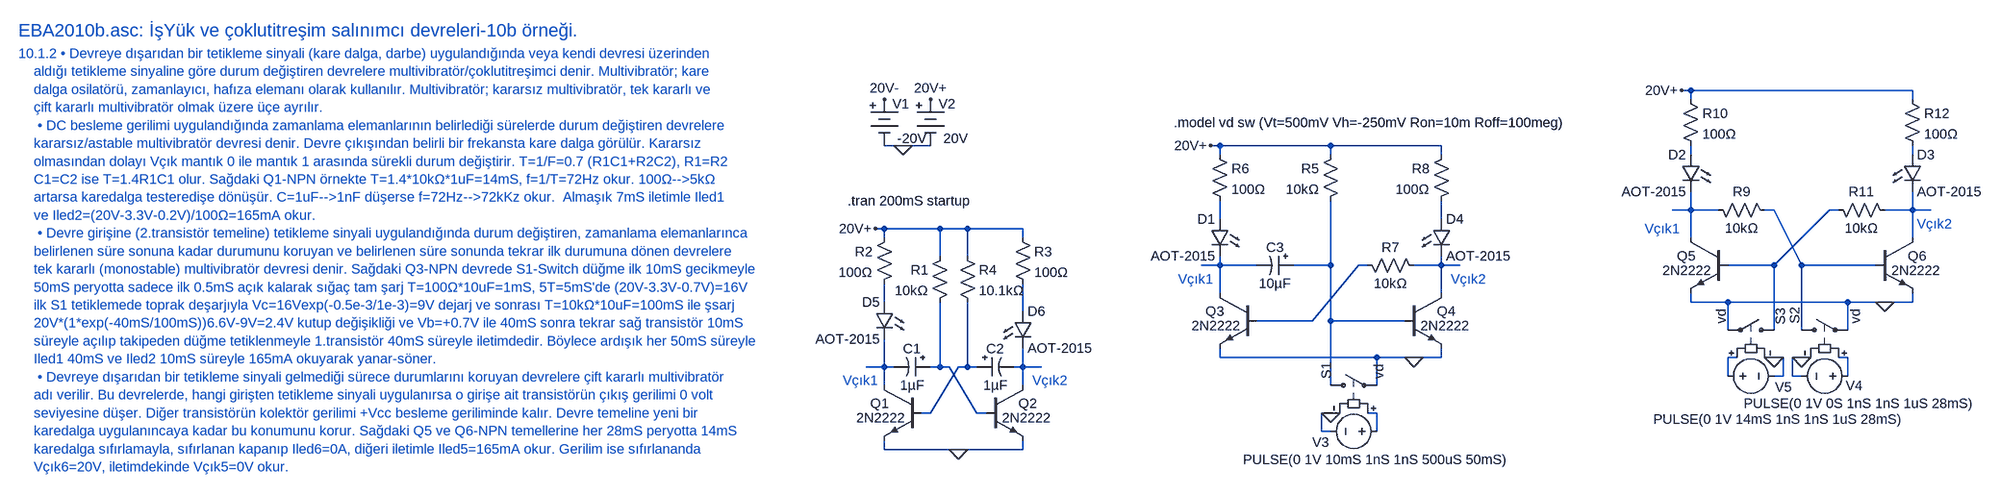
[diagram p0: schematic EBA2010b.asc]
EBA2010b.asc, the LTspice schematic file:
Version 4
SHEET 1 7064 4332
WIRE 2992 160 2976 160
WIRE 3376 160 2992 160
WIRE 2992 176 2992 160
WIRE 3376 176 3376 160
WIRE 1552 256 1520 256
WIRE 1600 256 1552 256
WIRE 2176 256 2160 256
WIRE 2368 256 2176 256
WIRE 2560 256 2368 256
WIRE 2176 272 2176 256
WIRE 2368 272 2368 256
WIRE 2560 272 2560 256
WIRE 2992 272 2992 256
WIRE 3376 272 3376 256
WIRE 2992 368 2992 336
WIRE 2992 368 2960 368
WIRE 3040 368 2992 368
WIRE 3136 368 3120 368
WIRE 3248 368 3232 368
WIRE 3376 368 3376 336
WIRE 3376 368 3328 368
WIRE 3408 368 3376 368
WIRE 2176 384 2176 352
WIRE 2560 384 2560 352
WIRE 1520 400 1504 400
WIRE 1616 400 1520 400
WIRE 1664 400 1616 400
WIRE 1760 400 1664 400
WIRE 1520 416 1520 400
WIRE 1760 416 1760 400
WIRE 2992 416 2992 368
WIRE 3376 416 3376 368
WIRE 1616 448 1616 400
WIRE 1664 448 1664 400
WIRE 2176 464 2176 448
WIRE 2176 464 2144 464
WIRE 2240 464 2176 464
WIRE 2368 464 2368 352
WIRE 2368 464 2304 464
WIRE 2432 464 2416 464
WIRE 2560 464 2560 448
WIRE 2560 464 2512 464
WIRE 2592 464 2560 464
WIRE 3136 464 3232 368
WIRE 3136 464 3056 464
WIRE 3184 464 3136 368
WIRE 3312 464 3184 464
WIRE 2176 512 2176 464
WIRE 2560 512 2560 464
WIRE 1520 528 1520 496
WIRE 2992 528 2992 512
WIRE 3056 528 2992 528
WIRE 3264 528 3056 528
WIRE 3328 528 3264 528
WIRE 3376 528 3376 512
WIRE 3376 528 3328 528
WIRE 1760 544 1760 496
WIRE 2336 560 2416 464
WIRE 2336 560 2240 560
WIRE 2368 560 2368 464
WIRE 2496 560 2368 560
WIRE 3056 576 3056 528
WIRE 3136 576 3136 464
WIRE 3184 576 3184 464
WIRE 3264 576 3264 528
WIRE 2176 624 2176 608
WIRE 2448 624 2176 624
WIRE 2512 624 2448 624
WIRE 2560 624 2560 608
WIRE 2560 624 2512 624
WIRE 3072 624 3056 624
WIRE 3136 624 3120 624
WIRE 3152 624 3136 624
WIRE 3184 624 3168 624
WIRE 3200 624 3184 624
WIRE 3264 624 3248 624
WIRE 1520 640 1520 592
WIRE 1520 640 1488 640
WIRE 1536 640 1520 640
WIRE 1616 640 1616 528
WIRE 1616 640 1600 640
WIRE 1632 640 1616 640
WIRE 1664 640 1664 528
WIRE 1664 640 1648 640
WIRE 1680 640 1664 640
WIRE 1760 640 1760 608
WIRE 1760 640 1744 640
WIRE 1792 640 1760 640
WIRE 3056 656 3056 624
WIRE 3152 656 3152 624
WIRE 3152 656 3136 656
WIRE 3168 656 3168 624
WIRE 3184 656 3168 656
WIRE 3264 656 3264 624
WIRE 1520 672 1520 640
WIRE 1760 672 1760 640
WIRE 2368 672 2368 560
WIRE 2448 672 2448 624
WIRE 1600 720 1648 640
WIRE 1600 720 1584 720
WIRE 1680 720 1632 640
WIRE 1696 720 1680 720
WIRE 2368 720 2352 720
WIRE 2384 720 2368 720
WIRE 2448 720 2432 720
WIRE 2352 752 2352 720
WIRE 2368 752 2352 752
WIRE 2448 752 2448 720
WIRE 1520 784 1520 768
WIRE 1648 784 1520 784
WIRE 1760 784 1760 768
WIRE 1760 784 1648 784
FLAG 1520 176 20V-
FLAG 1552 256 0
FLAG 1600 176 20V+
FLAG 1648 784 0
FLAG 1504 400 20V+
FLAG 2368 720 0
FLAG 2512 624 0
FLAG 2160 256 20V+
FLAG 3184 624 0
FLAG 3328 528 0
FLAG 3136 624 0
FLAG 2976 160 20V+
SYMBOL Misc\\battery 1520 160 R0
WINDOW 3 22 84 Left 2
WINDOW 0 14 24 Left 2
SYMATTR Value -20V
SYMATTR InstName V1
SYMBOL Misc\\battery 1600 160 R0
WINDOW 3 22 84 Left 2
WINDOW 0 14 24 Left 2
SYMATTR Value 20V
SYMATTR InstName V2
SYMBOL npn 1584 672 M0
WINDOW 3 28 57 Left 2
SYMATTR Value 2N2222
SYMATTR InstName Q1
SYMBOL res 1632 432 M0
SYMATTR InstName R1
SYMATTR Value 10kΩ
SYMBOL polcap 1600 624 R90
WINDOW 0 0 32 VBottom 2
WINDOW 3 32 32 VTop 2
SYMATTR InstName C1
SYMATTR Value 1µF
SYMBOL res 1536 400 M0
SYMATTR InstName R2
SYMATTR Value 100Ω
SYMBOL npn 1696 672 R0
WINDOW 3 28 57 Left 2
SYMATTR Value 2N2222
SYMATTR InstName Q2
SYMBOL res 1744 400 R0
SYMATTR InstName R3
SYMATTR Value 100Ω
SYMBOL polcap 1680 624 M90
WINDOW 0 0 32 VBottom 2
WINDOW 3 32 32 VTop 2
SYMATTR InstName C2
SYMATTR Value 1µF
SYMBOL res 1648 432 R0
SYMATTR InstName R4
SYMATTR Value 10.1kΩ
SYMBOL npn 2240 512 M0
WINDOW 3 28 57 Left 2
SYMATTR Value 2N2222
SYMATTR InstName Q3
SYMBOL LED 2192 384 M0
SYMATTR InstName D1
SYMATTR Value AOT-2015
SYMATTR Description Diode
SYMATTR Type diode
SYMBOL res 2384 256 M0
SYMATTR InstName R5
SYMATTR Value 10kΩ
SYMBOL res 2160 256 R0
SYMATTR InstName R6
SYMATTR Value 100Ω
SYMBOL npn 2496 512 R0
WINDOW 3 28 57 Left 2
SYMATTR Value 2N2222
SYMATTR InstName Q4
SYMBOL res 2528 480 M270
WINDOW 0 32 56 VTop 2
WINDOW 3 0 56 VBottom 2
SYMATTR InstName R7
SYMATTR Value 10kΩ
SYMBOL res 2576 256 M0
SYMATTR InstName R8
SYMATTR Value 100Ω
SYMBOL sw 2352 672 R270
WINDOW 0 11 9 Left 2
WINDOW 3 10 100 Left 2
SYMATTR InstName S1
SYMATTR Value vd
SYMBOL voltage 2464 752 R90
WINDOW 0 19 98 VRight 2
WINDOW 3 49 -211 VRight 2
WINDOW 123 0 0 Left 0
WINDOW 39 0 0 Left 0
SYMATTR InstName V3
SYMATTR Value PULSE(0 1V 10mS 1nS 1nS 500uS 50mS)
SYMBOL polcap 2304 448 R90
WINDOW 0 0 32 VBottom 2
WINDOW 3 32 32 VTop 2
SYMATTR InstName C3
SYMATTR Value 10µF
SYMBOL npn 3056 416 M0
WINDOW 3 28 57 Left 2
SYMATTR Value 2N2222
SYMATTR InstName Q5
SYMBOL LED 3008 272 M0
SYMATTR InstName D2
SYMATTR Value AOT-2015
SYMATTR Description Diode
SYMATTR Type diode
SYMBOL res 3136 384 M270
WINDOW 0 32 56 VTop 2
WINDOW 3 0 56 VBottom 2
SYMATTR InstName R9
SYMATTR Value 10kΩ
SYMBOL res 2976 160 R0
SYMATTR InstName R10
SYMATTR Value 100Ω
SYMBOL npn 3312 416 R0
WINDOW 3 28 57 Left 2
SYMATTR Value 2N2222
SYMATTR InstName Q6
SYMBOL res 3344 384 M270
WINDOW 0 32 56 VTop 2
WINDOW 3 0 56 VBottom 2
SYMATTR InstName R11
SYMATTR Value 10kΩ
SYMBOL sw 3168 576 R270
WINDOW 0 11 5 Left 2
WINDOW 3 10 110 Left 2
SYMATTR InstName S2
SYMATTR Value vd
SYMBOL voltage 3280 656 R90
WINDOW 0 17 -10 VRight 2
WINDOW 3 48 -202 VRight 2
WINDOW 123 0 0 Left 0
WINDOW 39 0 0 Left 0
SYMATTR InstName V4
SYMATTR Value PULSE(0 1V 0S 1nS 1nS 1uS 28mS)
SYMBOL LED 3360 272 R0
SYMATTR InstName D3
SYMATTR Value AOT-2015
SYMATTR Description Diode
SYMATTR Type diode
SYMBOL res 3360 160 R0
SYMATTR InstName R12
SYMATTR Value 100Ω
SYMBOL sw 3152 576 M270
WINDOW 0 9 4 Left 2
WINDOW 3 10 107 Left 2
SYMATTR InstName S3
SYMATTR Value vd
SYMBOL voltage 3040 656 M90
WINDOW 0 19 98 VRight 2
WINDOW 3 75 -113 VRight 2
WINDOW 123 0 0 Left 0
WINDOW 39 0 0 Left 0
SYMATTR InstName V5
SYMATTR Value PULSE(0 1V 14mS 1nS 1nS 1uS 28mS)
SYMBOL LED 2544 384 R0
SYMATTR InstName D4
SYMATTR Value AOT-2015
SYMATTR Description Diode
SYMATTR Type diode
SYMBOL LED 1536 528 M0
SYMATTR InstName D5
SYMATTR Value AOT-2015
SYMATTR Description Diode
SYMATTR Type diode
SYMBOL LED 1744 544 R0
SYMATTR InstName D6
SYMATTR Value AOT-2015
SYMATTR Description Diode
SYMATTR Type diode
TEXT -232 56 Left 3 ;EBA2010b.asc: İşYük ve çoklutitreşim salınımcı devreleri-10b örneği.
TEXT -232 96 Left 2 ;10.1.2 • Devreye dışarıdan bir tetikleme sinyali (kare dalga, darbe) uygulandığında veya kendi devresi üzerinden\n    aldığı tetikleme sinyaline göre durum değiştiren devrelere multivibratör/çoklutitreşimci denir. Multivibratör; kare\n    dalga osilatörü, zamanlayıcı, hafıza elemanı olarak kullanılır. Multivibratör; kararsız multivibratör, tek kararlı ve \n    çift kararlı multivibratör olmak üzere üçe ayrılır.\n     • DC besleme gerilimi uygulandığında zamanlama elemanlarının belirlediği sürelerde durum değiştiren devrelere \n    kararsız/astable multivibratör devresi denir. Devre çıkışından belirli bir frekansta kare dalga görülür. Kararsız \n    olmasından dolayı Vçık mantık 0 ile mantık 1 arasında sürekli durum değiştirir. T=1/F=0.7 (R1C1+R2C2), R1=R2\n    C1=C2 ise T=1.4R1C1 olur. Sağdaki Q1-NPN örnekte T=1.4*10kΩ*1uF=14mS, f=1/T=72Hz okur. 100Ω-->5kΩ\n    artarsa karedalga testeredişe dönüşür. C=1uF-->1nF düşerse f=72Hz-->72kKz okur.  Almaşık 7mS iletimle Iled1 \n    ve Iled2=(20V-3.3V-0.2V)/100Ω=165mA okur.\n     • Devre girişine (2.transistör temeline) tetikleme sinyali uygulandığında durum değiştiren, zamanlama elemanlarınca\n    belirlenen süre sonuna kadar durumunu koruyan ve belirlenen süre sonunda tekrar ilk durumuna dönen devrelere\n    tek kararlı (monostable) multivibratör devresi denir. Sağdaki Q3-NPN devrede S1-Switch düğme ilk 10mS gecikmeyle \n    50mS peryotta sadece ilk 0.5mS açık kalarak sığaç tam şarj T=100Ω*10uF=1mS, 5T=5mS'de (20V-3.3V-0.7V)=16V\n    ilk S1 tetiklemede toprak deşarjıyla Vc=16Vexp(-0.5e-3/1e-3)=9V dejarj ve sonrası T=10kΩ*10uF=100mS ile şsarj \n    20V*(1*exp(-40mS/100mS))6.6V-9V=2.4V kutup değişikliği ve Vb=+0.7V ile 40mS sonra tekrar sağ transistör 10mS\n    süreyle açılıp takipeden düğme tetiklenmeyle 1.transistör 40mS süreyle iletimdedir. Böylece ardışık her 50mS süreyle \n    Iled1 40mS ve Iled2 10mS süreyle 165mA okuyarak yanar-söner.\n     • Devreye dışarıdan bir tetikleme sinyali gelmediği sürece durumlarını koruyan devrelere çift kararlı multivibratör \n    adı verilir. Bu devrelerde, hangi girişten tetikleme sinyali uygulanırsa o girişe ait transistörün çıkış gerilimi 0 volt\n    seviyesine düşer. Diğer transistörün kolektör gerilimi +Vcc besleme geriliminde kalır. Devre temeline yeni bir \n    karedalga uygulanıncaya kadar bu konumunu korur. Sağdaki Q5 ve Q6-NPN temellerine her 28mS peryotta 14mS\n    karedalga sıfırlamayla, sıfırlanan kapanıp Iled6=0A, diğeri iletimle Iled5=165mA okur. Gerilim ise sıfırlananda \n    Vçık6=20V, iletimdekinde Vçık5=0V okur.
TEXT 1456 352 Left 2 !.tran 200mS startup
TEXT 1448 664 Left 2 ;Vçık1
TEXT 1776 664 Left 2 ;Vçık2
TEXT 2104 488 Left 2 ;Vçık1
TEXT 2576 488 Left 2 ;Vçık2
TEXT 2096 216 Left 2 !.model vd sw (Vt=500mV Vh=-250mV Ron=10m Roff=100meg)
TEXT 2912 400 Left 2 ;Vçık1
TEXT 3384 392 Left 2 ;Vçık2

The netlist it stands for:
* EBA2010b.asc
V1 20V- 0 -20V
V2 20V+ 0 20V
Q1 N017 N019 0 0 2N2222
R1 20V+ N018 10kΩ
C1 N018 N017 1µF
R2 20V+ N013 100Ω
Q2 N020 N018 0 0 2N2222
R3 20V+ N014 100Ω
C2 N019 N020 1µF
R4 20V+ N019 10.1kΩ
Q3 N009 N011 0 0 2N2222
D1 N007 N009 AOT-2015
R5 20V+ N010 10kΩ
R6 20V+ N007 100Ω
Q4 N012 N010 0 0 2N2222
R7 N012 N011 10kΩ
R8 20V+ N008 100Ω
S1 N010 0 N021 0 vd
V3 N021 0 PULSE(0 1V 10mS 1nS 1nS 500uS 50mS)
C3 N010 N009 10µF
Q5 N003 N005 0 0 2N2222
D2 N001 N003 AOT-2015
R9 N004 N003 10kΩ
R10 20V+ N001 100Ω
Q6 N006 N004 0 0 2N2222
R11 N006 N005 10kΩ
S2 N004 0 N016 0 vd
V4 N016 0 PULSE(0 1V 0S 1nS 1nS 1uS 28mS)
D3 N002 N006 AOT-2015
R12 20V+ N002 100Ω
S3 N005 0 N015 0 vd
V5 N015 0 PULSE(0 1V 14mS 1nS 1nS 1uS 28mS)
D4 N008 N012 AOT-2015
D5 N013 N017 AOT-2015
D6 N014 N020 AOT-2015
.model D D
.lib standard.dio
.model NPN NPN
.model PNP PNP
.lib standard.bjt
* EBA2010b.asc: İşYük ve çoklutitreşim salınımcı devreleri-10b örneği.
* 10.1.2 • Devreye dışarıdan bir tetikleme sinyali (kare dalga, darbe) uygulandığında veya kendi devresi üzerinden
*     aldığı tetikleme sinyaline göre durum değiştiren devrelere multivibratör/çoklutitreşimci denir. Multivibratör; kare
*     dalga osilatörü, zamanlayıcı, hafıza elemanı olarak kullanılır. Multivibratör; kararsız multivibratör, tek kararlı ve
*     çift kararlı multivibratör olmak üzere üçe ayrılır.
*      • DC besleme gerilimi uygulandığında zamanlama elemanlarının belirlediği sürelerde durum değiştiren devrelere
*     kararsız/astable multivibratör devresi denir. Devre çıkışından belirli bir frekansta kare dalga görülür. Kararsız
*     olmasından dolayı Vçık mantık 0 ile mantık 1 arasında sürekli durum değiştirir. T=1/F=0.7 (R1C1+R2C2), R1=R2
*     C1=C2 ise T=1.4R1C1 olur. Sağdaki Q1-NPN örnekte T=1.4*10kΩ*1uF=14mS, f=1/T=72Hz okur. 100Ω-->5kΩ
*     artarsa karedalga testeredişe dönüşür. C=1uF-->1nF düşerse f=72Hz-->72kKz okur.  Almaşık 7mS iletimle Iled1
*     ve Iled2=(20V-3.3V-0.2V)/100Ω=165mA okur.
*      • Devre girişine (2.transistör temeline) tetikleme sinyali uygulandığında durum değiştiren, zamanlama elemanlarınca
*     belirlenen süre sonuna kadar durumunu koruyan ve belirlenen süre sonunda tekrar ilk durumuna dönen devrelere
*     tek kararlı (monostable) multivibratör devresi denir. Sağdaki Q3-NPN devrede S1-Switch düğme ilk 10mS gecikmeyle
*     50mS peryotta sadece ilk 0.5mS açık kalarak sığaç tam şarj T=100Ω*10uF=1mS, 5T=5mS'de (20V-3.3V-0.7V)=16V
*     ilk S1 tetiklemede toprak deşarjıyla Vc=16Vexp(-0.5e-3/1e-3)=9V dejarj ve sonrası T=10kΩ*10uF=100mS ile şsarj
*     20V*(1*exp(-40mS/100mS))6.6V-9V=2.4V kutup değişikliği ve Vb=+0.7V ile 40mS sonra tekrar sağ transistör 10mS
*     süreyle açılıp takipeden düğme tetiklenmeyle 1.transistör 40mS süreyle iletimdedir. Böylece ardışık her 50mS süreyle
*     Iled1 40mS ve Iled2 10mS süreyle 165mA okuyarak yanar-söner.
*      • Devreye dışarıdan bir tetikleme sinyali gelmediği sürece durumlarını koruyan devrelere çift kararlı multivibratör
*     adı verilir. Bu devrelerde, hangi girişten tetikleme sinyali uygulanırsa o girişe ait transistörün çıkış gerilimi 0 volt
*     seviyesine düşer. Diğer transistörün kolektör gerilimi +Vcc besleme geriliminde kalır. Devre temeline yeni bir
*     karedalga uygulanıncaya kadar bu konumunu korur. Sağdaki Q5 ve Q6-NPN temellerine her 28mS peryotta 14mS
*     karedalga sıfırlamayla, sıfırlanan kapanıp Iled6=0A, diğeri iletimle Iled5=165mA okur. Gerilim ise sıfırlananda
*     Vçık6=20V, iletimdekinde Vçık5=0V okur.
.tran 200mS startup
* Vçık1
* Vçık2
* Vçık1
* Vçık2
.model vd sw (Vt=500mV Vh=-250mV Ron=10m Roff=100meg)
* Vçık1
* Vçık2
.backanno
.end